# EAGLE schematic Clock (EAGLE 9.6.2)
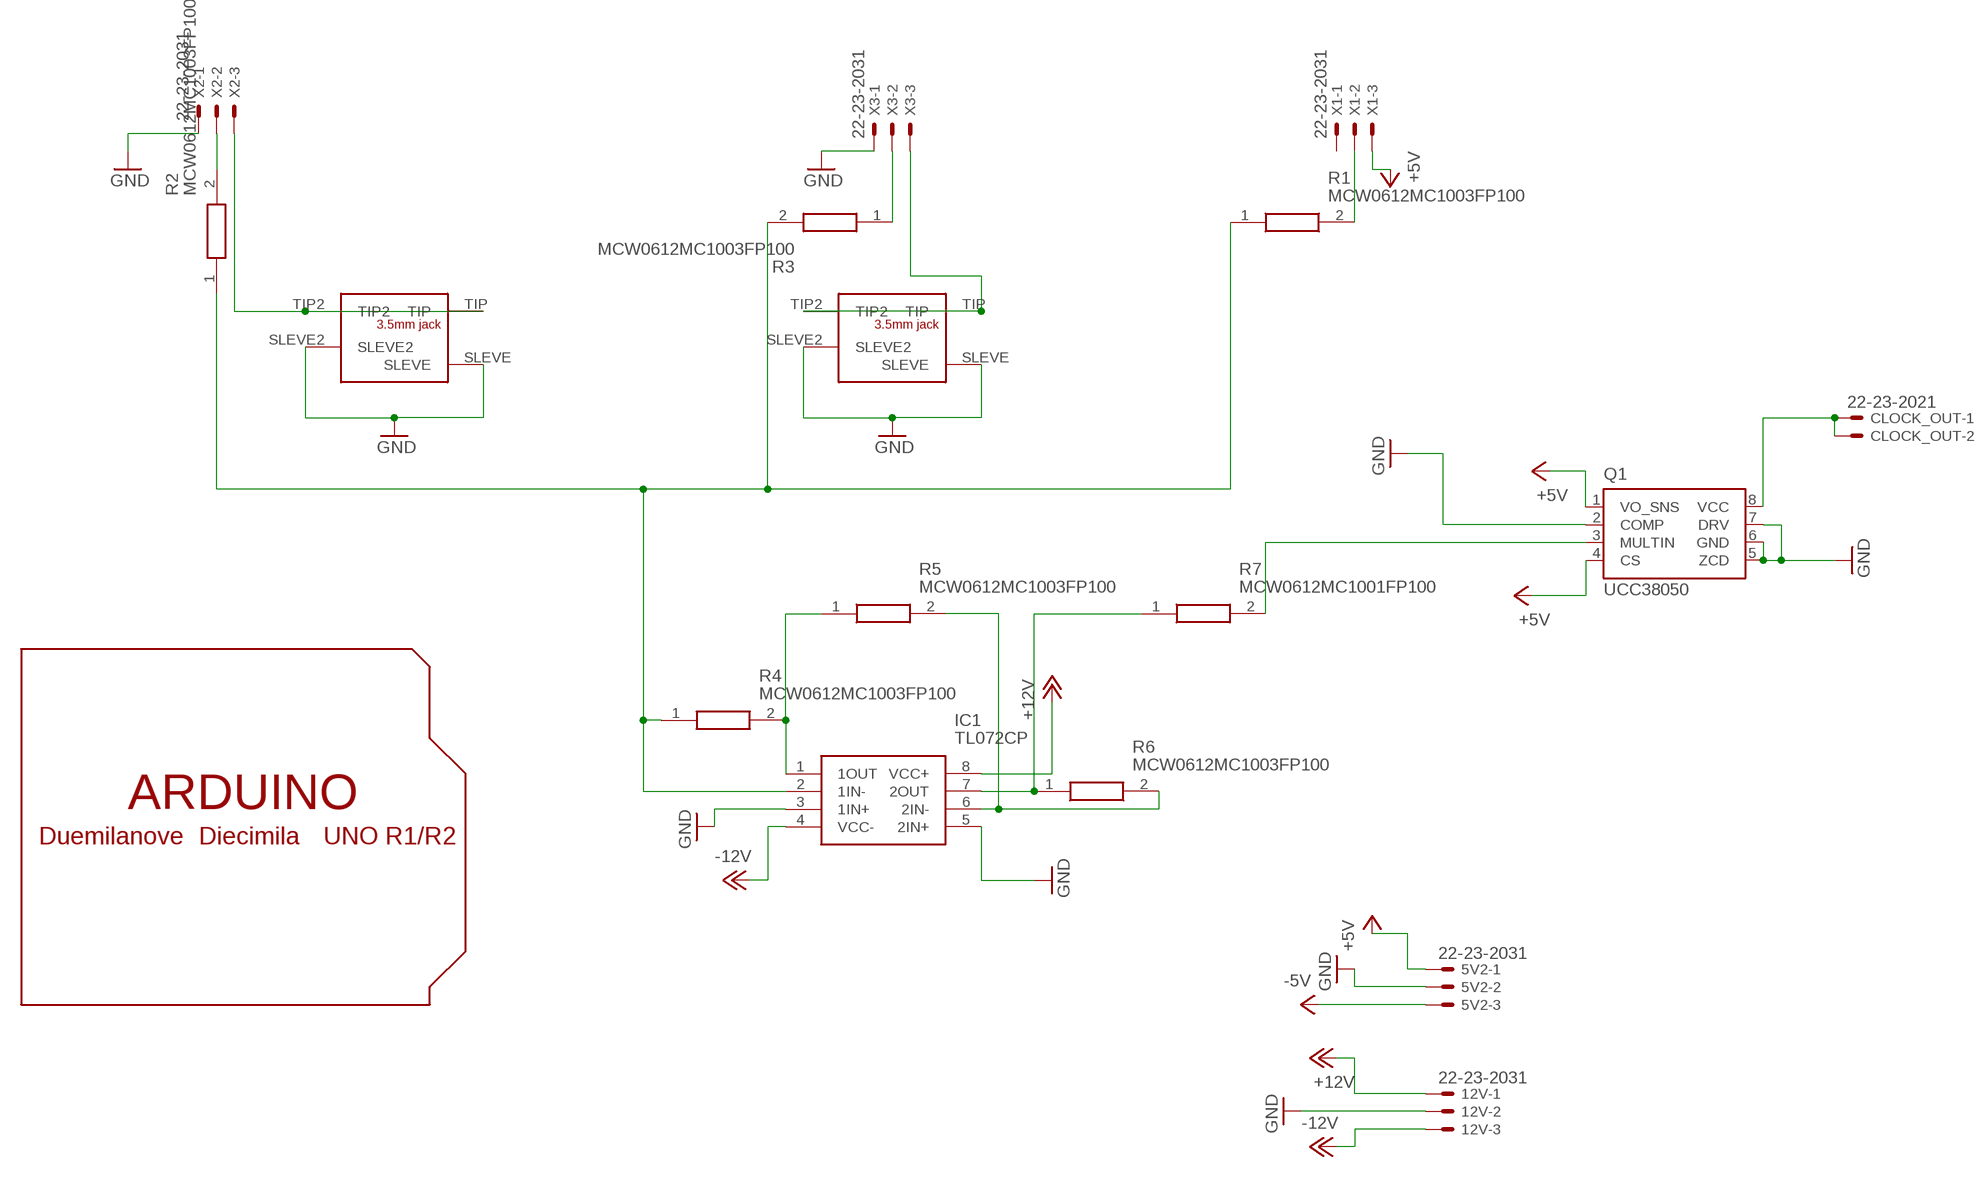
[diagram p0: schematic, sheet 1]

## Parts
5V2  22-23-2031  [22-23-2031]
12V  22-23-2031  [22-23-2031]
CLOCK_OUT  22-23-2021  [22-23-2021]
IC1  TL072CP  [DIP794W53P254L959H508Q8N]
Q1  UCC38050  [DIP-8]
R1  MCW0612MC1003FP100  [RESC1631X60N]
R2  MCW0612MC1003FP100  [RESC1631X60N]
R3  MCW0612MC1003FP100  [RESC1631X60N]
R4  MCW0612MC1003FP100  [RESC1631X60N]
R5  MCW0612MC1003FP100  [RESC1631X60N]
R6  MCW0612MC1003FP100  [RESC1631X60N]
R7  MCW0612MC1001FP100  [RESC1732X65N]
U$1  ARDUINOHOLE  [ARDUINOHOLE]
U$2  CL13845G  [CL13845G]
U$3  CL13845G  [CL13845G]
X1  22-23-2031  [22-23-2031]
X2  22-23-2031  [22-23-2031]
X3  22-23-2031  [22-23-2031]

## Nets
+5V: 5V2.1 Q1.1(VO_SNS) Q1.4(CS) X1.3
+12V: 12V.1 IC1.8(VCC+)
-5V: 5V2.3
-12V: 12V.3 IC1.4(VCC-)
GND: 5V2.2 12V.2 IC1.3(1IN+) IC1.5(2IN+) Q1.2(COMP) Q1.5(ZCD) Q1.6(GND) Q1.7(DRV) U$2.SLEVE U$2.SLEVE2 U$3.SLEVE U$3.SLEVE2 X2.1 X3.1
N$1: Q1.3(MULTIN) R7.2
N$2: R3.1 X3.2
N$3: R2.2 X2.2
N$4: U$2.TIP U$2.TIP2 X2.3
N$5: U$3.TIP U$3.TIP2 X3.3
N$6: R1.2 X1.2
N$7: IC1.2(1IN-) R1.1 R2.1 R3.2 R4.1
N$8: IC1.1(1OUT) R4.2 R5.1
N$9: IC1.7(2OUT) R6.1 R7.1
N$10: IC1.6(2IN-) R5.2 R6.2
N$11: CLOCK_OUT.1 CLOCK_OUT.2 Q1.8(VCC)
Unconnected: X1.1

## Library data of the parts
5V2 12V X1-X3 = con-molex:22-23-2031: .100" (2.54mm) Center Header - 3 Pin; MF: MOLEX; MPN: 22-23-2031; OC_FARNELL: 1462950; OC_NEWARK: 30C0862
CLOCK_OUT = con-molex:22-23-2021: .100" (2.54mm) Center Header - 2 Pin; MF: MOLEX; MPN: 22-23-2021; OC_FARNELL: 1462926; OC_NEWARK: 25C3832
IC1 = SamacSys_Parts:TL072CP: Dual Low-Noise JFET-Input General-Purpose Operational Amplifier Source: Datasheet <http://www.ti.com/lit/ds/symlink/tl071a.pdf>; DESCRIPTION: Dual Low-Noise JFET-Input General-Purpose Operational Amplifier; HEIGHT: 5.08mm; MANUFACTURER_NAME: Texas Instruments; MANUFACTURER_PART_NUMBER: TL072CP; MOUSER_PART_NUMBER: 595-TL072CP; MOUSER_PRICE-STOCK: https://www.mouser.co.uk/ProductDetail/Texas-Instruments/TL072CP?qs=5nGYs9Do7G3e6Tx9uHIgUA%3D%3D
Q1 = ti-parts:UCC38050: TRANSITION MODE PFC CONTROLLER
R1-R6 = SamacSys_Parts:MCW0612MC1003FP100: Thin Film Resistors - SMD 1watt 100Kohms 1% 50ppm Source: Datasheet <http://www.mouser.com/datasheet/2/427/mcw0406atpro-1018654.pdf>; DESCRIPTION: Thin Film Resistors - SMD 1watt 100Kohms 1% 50ppm; HEIGHT: 0.6mm; MANUFACTURER_NAME: Vishay; MANUFACTURER_PART_NUMBER: MCW0612MC1003FP100; MOUSER_PART_NUMBER: 594-MCW0612MC1003FP1; MOUSER_PRICE-STOCK: https://www.mouser.com/Search/Refine.aspx?Keyword=594-MCW0612MC1003FP1
R7 = SamacSys_Parts:MCW0612MC1001FP100: VISHAY - MCW0612MC1001FP100 - RES, AEC-Q200, 1K, 1%, 1W, 0612 Source: Datasheet <https://ms.componentsearchengine.com/Datasheets/2/MCW0612MC1001FP100.pdf>; DESCRIPTION: VISHAY - MCW0612MC1001FP100 - RES, AEC-Q200, 1K, 1%, 1W, 0612; HEIGHT: 0.65mm; MANUFACTURER_NAME: Vishay; MANUFACTURER_PART_NUMBER: MCW0612MC1001FP100
U$1 = arduino uno pin only:ARDUINOHOLE: Arduino Diecimila/Duemilanove Make a shield with ease, this package has all the named pins as well as the two mounting drill holes and an outline of the USB and DC power connector. The outline is on the DIMENSION layer, so if your board house uses it they will cut the outline to match. http://www.ladyada.net/library/pcb/eaglelibrary.html
U$2 U$3 = arduino uno pin only:CL13845G